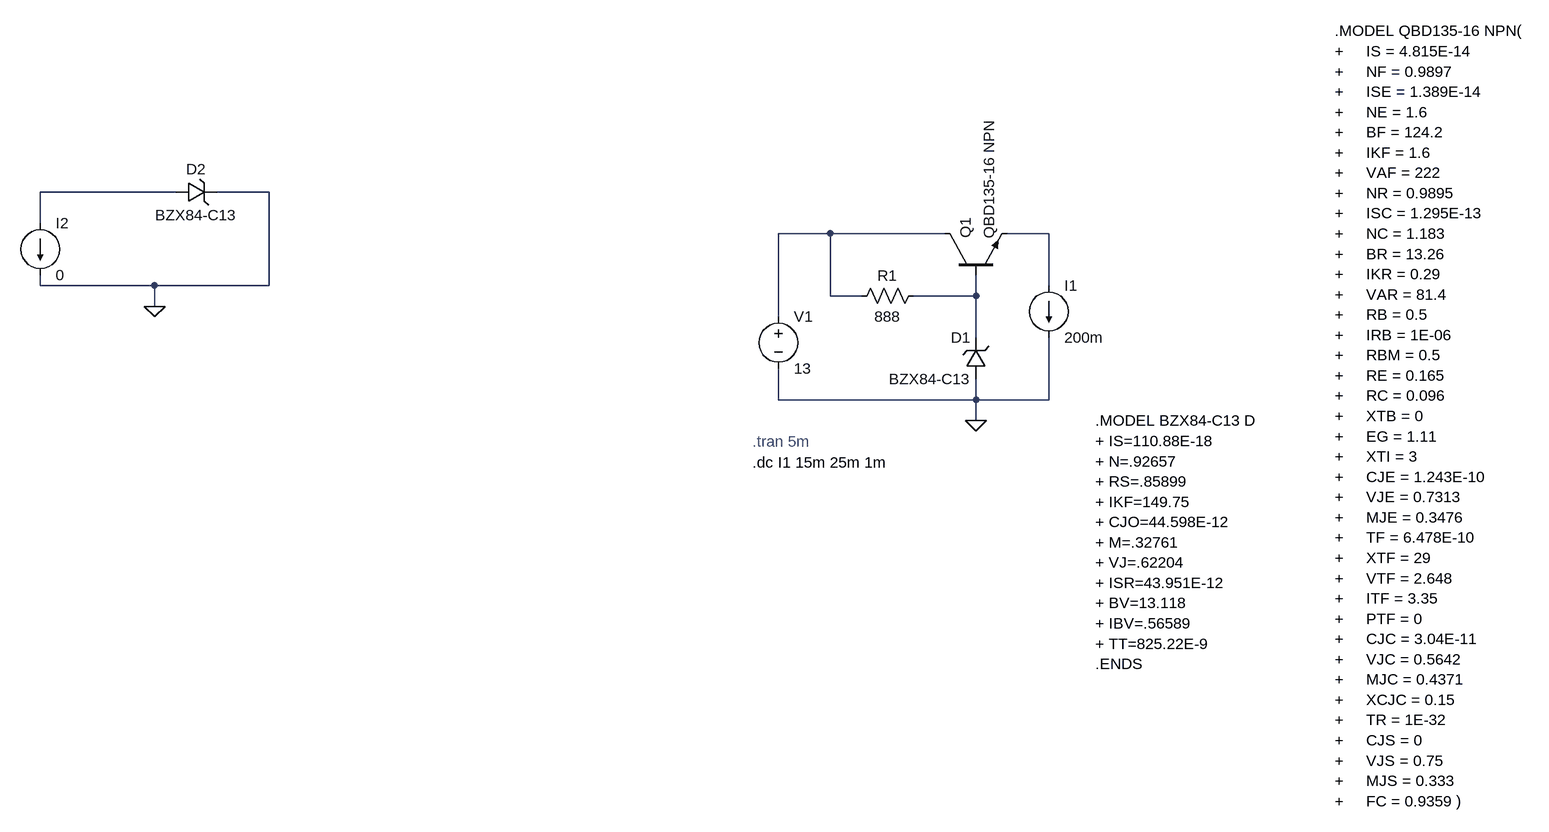
[diagram p0: schematic Draft2.asc]
Draft2.asc, the LTspice schematic file:
Version 4
SHEET 1 1852 736
WIRE -864 -96 -1072 -96
WIRE -720 -96 -800 -96
WIRE -1072 -48 -1072 -96
WIRE 144 -32 64 -32
WIRE 320 -32 144 -32
WIRE 480 -32 416 -32
WIRE -1072 48 -1072 32
WIRE -896 48 -1072 48
WIRE -720 48 -720 -96
WIRE -720 48 -896 48
WIRE 480 48 480 -32
WIRE 144 64 144 -32
WIRE 192 64 144 64
WIRE 368 64 368 32
WIRE 368 64 272 64
WIRE -896 80 -896 48
WIRE 64 96 64 -32
WIRE 368 128 368 64
WIRE 64 224 64 176
WIRE 368 224 368 192
WIRE 368 224 64 224
WIRE 480 224 480 128
WIRE 480 224 368 224
WIRE 368 256 368 224
FLAG 368 256 0
FLAG -896 80 0
SYMBOL voltage 64 80 R0
SYMATTR InstName V1
SYMATTR Value 13
SYMBOL res 288 48 R90
WINDOW 0 0 56 VBottom 2
WINDOW 3 32 56 VTop 2
SYMATTR InstName R1
SYMATTR Value 888
SYMBOL npn2 320 32 R270
SYMATTR InstName Q1
SYMATTR Value QBD135-16 NPN
SYMBOL zener 384 192 R180
WINDOW 0 24 64 Left 2
WINDOW 3 24 0 Left 2
SYMATTR InstName D1
SYMATTR Value BZX84-C13
SYMBOL current 480 48 R0
WINDOW 123 0 0 Left 0
WINDOW 39 0 0 Left 0
SYMATTR InstName I1
SYMATTR Value 200m
SYMBOL zener -864 -80 R270
WINDOW 0 36 32 VTop 2
WINDOW 3 -4 32 VBottom 2
SYMATTR InstName D2
SYMATTR Value BZX84-C13
SYMBOL current -1072 -48 R0
SYMATTR InstName I2
SYMATTR Value 0
TEXT 24 288 Left 2 ;.tran 5m
TEXT 552 256 Left 2 !.MODEL BZX84-C13 D\n+ IS=110.88E-18\n+ N=.92657\n+ RS=.85899\n+ IKF=149.75\n+ CJO=44.598E-12\n+ M=.32761\n+ VJ=.62204\n+ ISR=43.951E-12\n+ BV=13.118\n+ IBV=.56589\n+ TT=825.22E-9\n.ENDS
TEXT 920 -344 Left 2 !.MODEL QBD135-16 NPN( \n+     IS = 4.815E-14 \n+     NF = 0.9897 \n+     ISE = 1.389E-14 \n+     NE = 1.6 \n+     BF = 124.2 \n+     IKF = 1.6 \n+     VAF = 222 \n+     NR = 0.9895 \n+     ISC = 1.295E-13 \n+     NC = 1.183 \n+     BR = 13.26 \n+     IKR = 0.29 \n+     VAR = 81.4 \n+     RB = 0.5 \n+     IRB = 1E-06 \n+     RBM = 0.5 \n+     RE = 0.165 \n+     RC = 0.096 \n+     XTB = 0 \n+     EG = 1.11 \n+     XTI = 3 \n+     CJE = 1.243E-10 \n+     VJE = 0.7313 \n+     MJE = 0.3476 \n+     TF = 6.478E-10 \n+     XTF = 29 \n+     VTF = 2.648 \n+     ITF = 3.35 \n+     PTF = 0 \n+     CJC = 3.04E-11 \n+     VJC = 0.5642 \n+     MJC = 0.4371 \n+     XCJC = 0.15 \n+     TR = 1E-32 \n+     CJS = 0 \n+     VJS = 0.75 \n+     MJS = 0.333 \n+     FC = 0.9359 )
TEXT 24 320 Left 2 !.dc I1 15m 25m 1m

The netlist it stands for:
* Draft2.asc
V1 N002 0 13
R1 N004 N002 888
Q1 N002 N004 N003 0 QBD135-16 NPN
D1 0 N004 BZX84-C13
I1 N003 0 200m
D2 N001 0 BZX84-C13
I2 N001 0 0
.model D D
.lib standard.dio
.model NPN NPN
.model PNP PNP
.lib standard.bjt
* .tran 5m
.MODEL BZX84-C13 D
+ IS=110.88E-18
+ N=.92657
+ RS=.85899
+ IKF=149.75
+ CJO=44.598E-12
+ M=.32761
+ VJ=.62204
+ ISR=43.951E-12
+ BV=13.118
+ IBV=.56589
+ TT=825.22E-9
.ENDS
.MODEL QBD135-16 NPN(
+     IS = 4.815E-14
+     NF = 0.9897
+     ISE = 1.389E-14
+     NE = 1.6
+     BF = 124.2
+     IKF = 1.6
+     VAF = 222
+     NR = 0.9895
+     ISC = 1.295E-13
+     NC = 1.183
+     BR = 13.26
+     IKR = 0.29
+     VAR = 81.4
+     RB = 0.5
+     IRB = 1E-06
+     RBM = 0.5
+     RE = 0.165
+     RC = 0.096
+     XTB = 0
+     EG = 1.11
+     XTI = 3
+     CJE = 1.243E-10
+     VJE = 0.7313
+     MJE = 0.3476
+     TF = 6.478E-10
+     XTF = 29
+     VTF = 2.648
+     ITF = 3.35
+     PTF = 0
+     CJC = 3.04E-11
+     VJC = 0.5642
+     MJC = 0.4371
+     XCJC = 0.15
+     TR = 1E-32
+     CJS = 0
+     VJS = 0.75
+     MJS = 0.333
+     FC = 0.9359 )
.dc I1 15m 25m 1m
.backanno
.end